# EAGLE schematic 1090-2 (EAGLE 6.0)
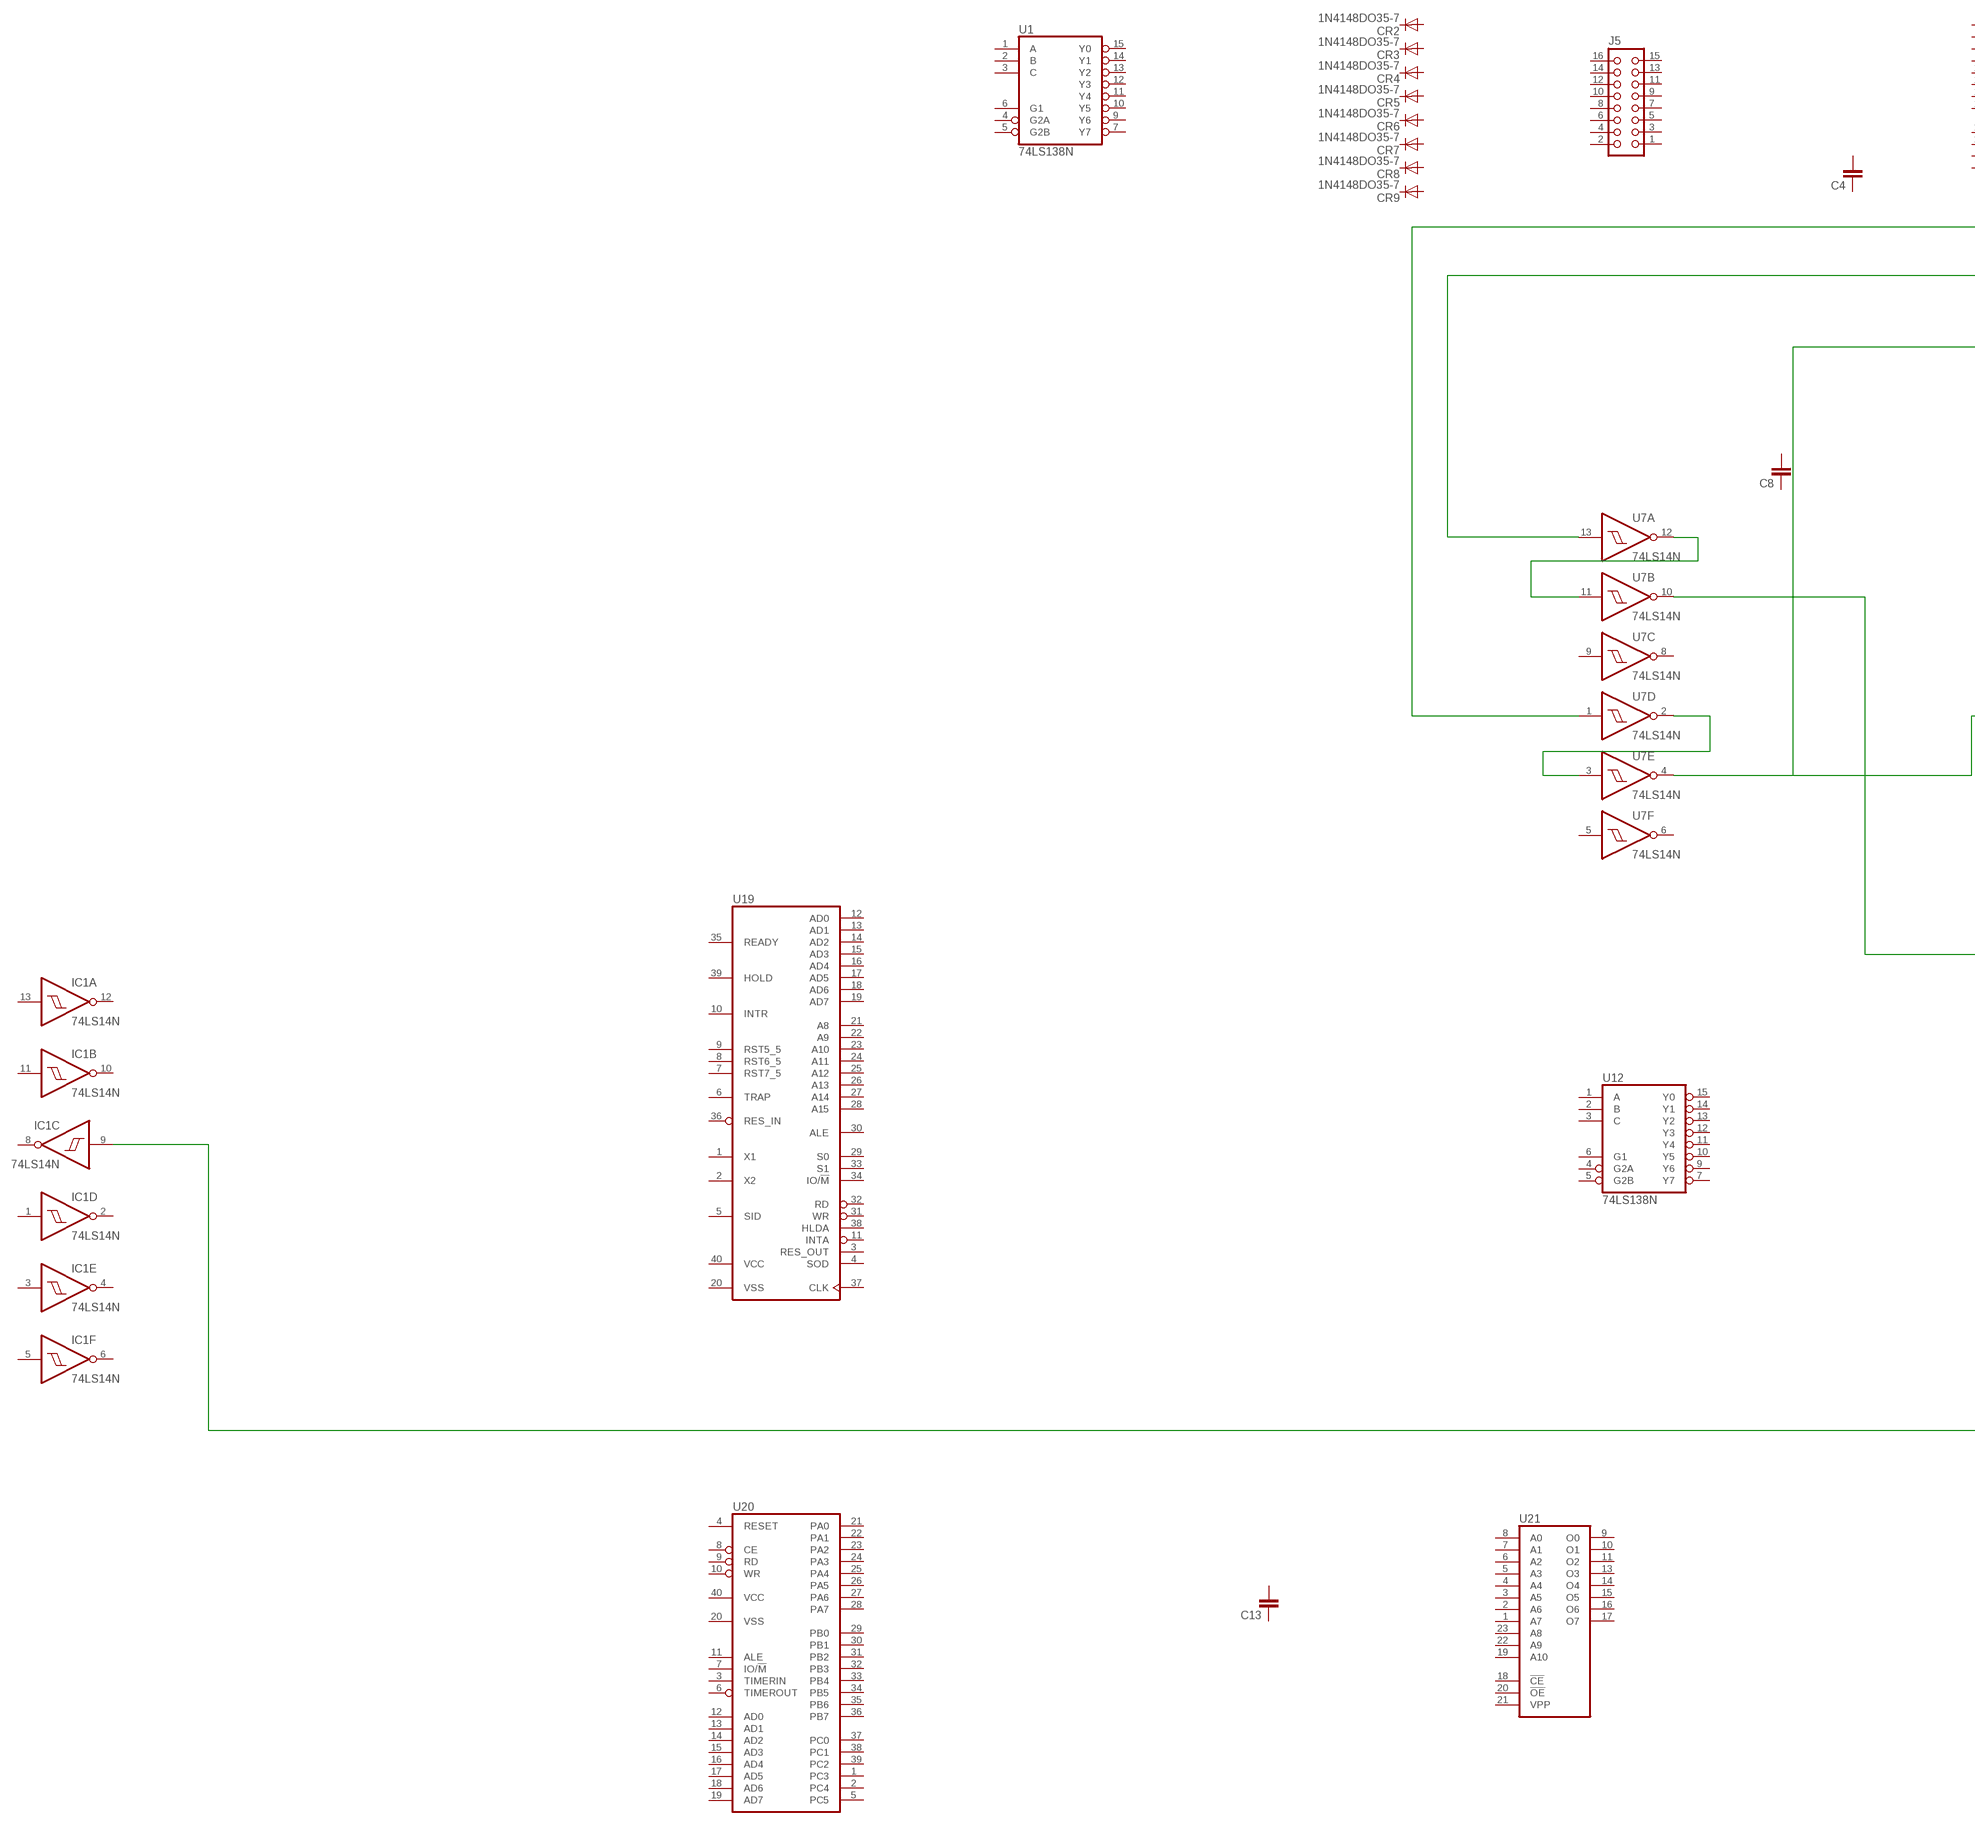
[diagram p0: schematic, sheet 1, part 1 of 3]
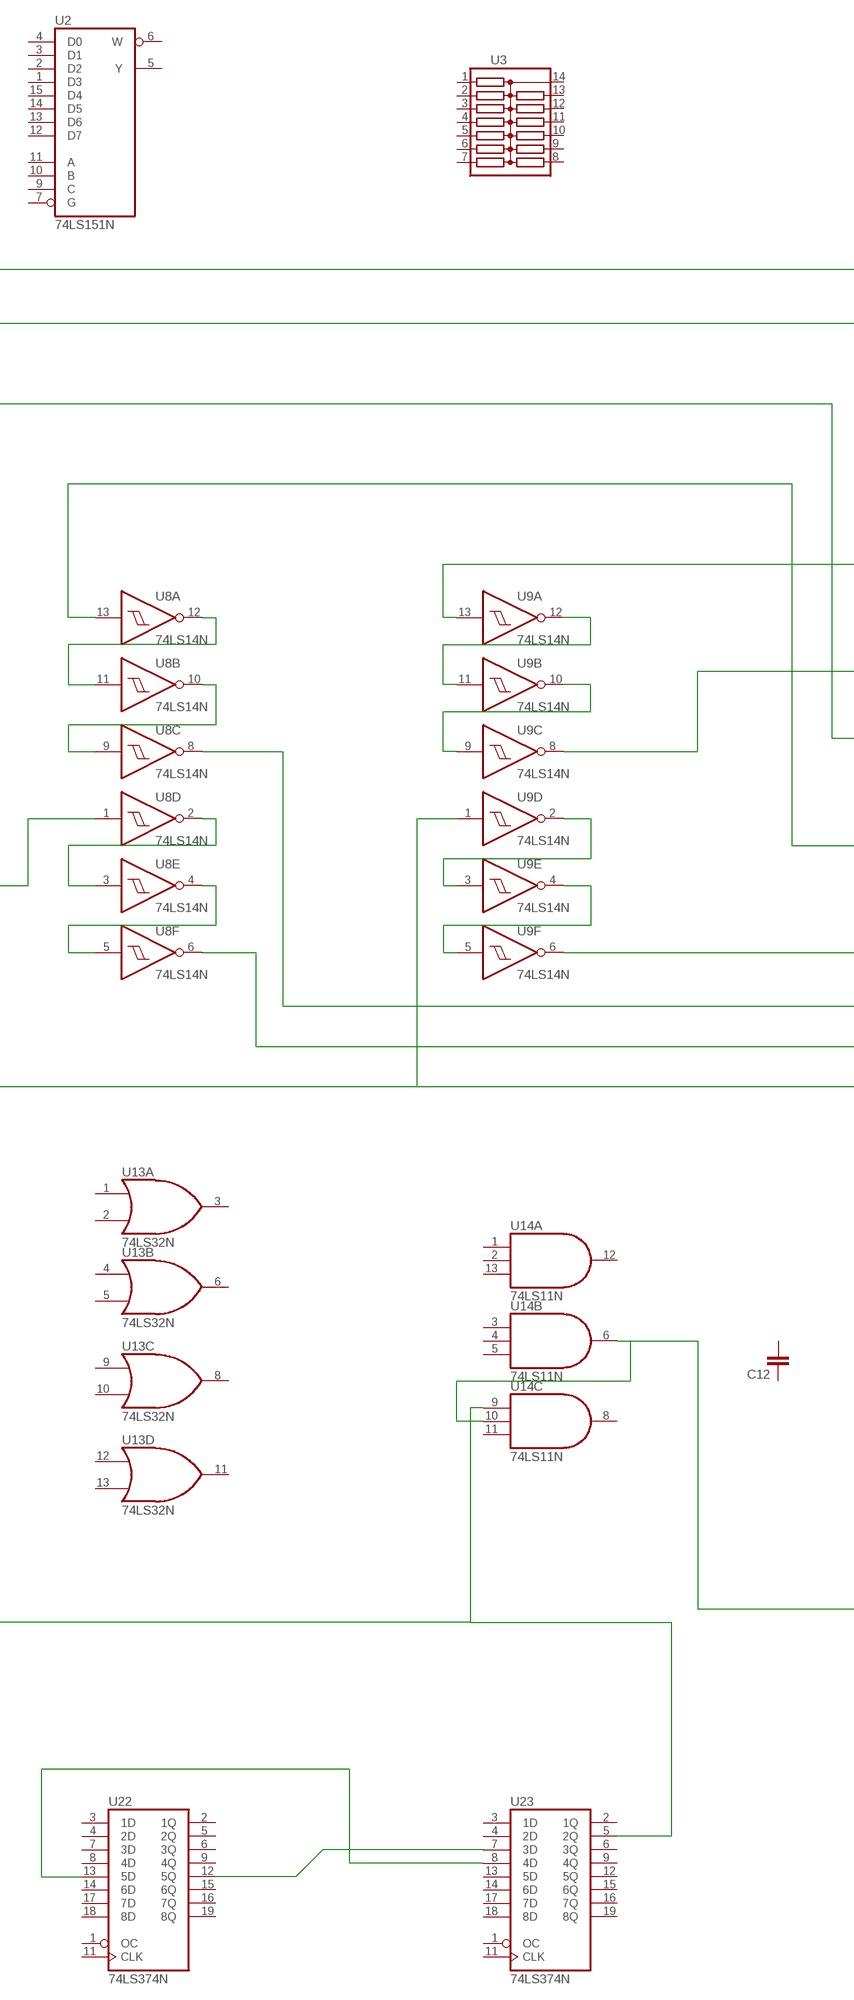
[diagram p1: schematic, sheet 1, part 2 of 3]
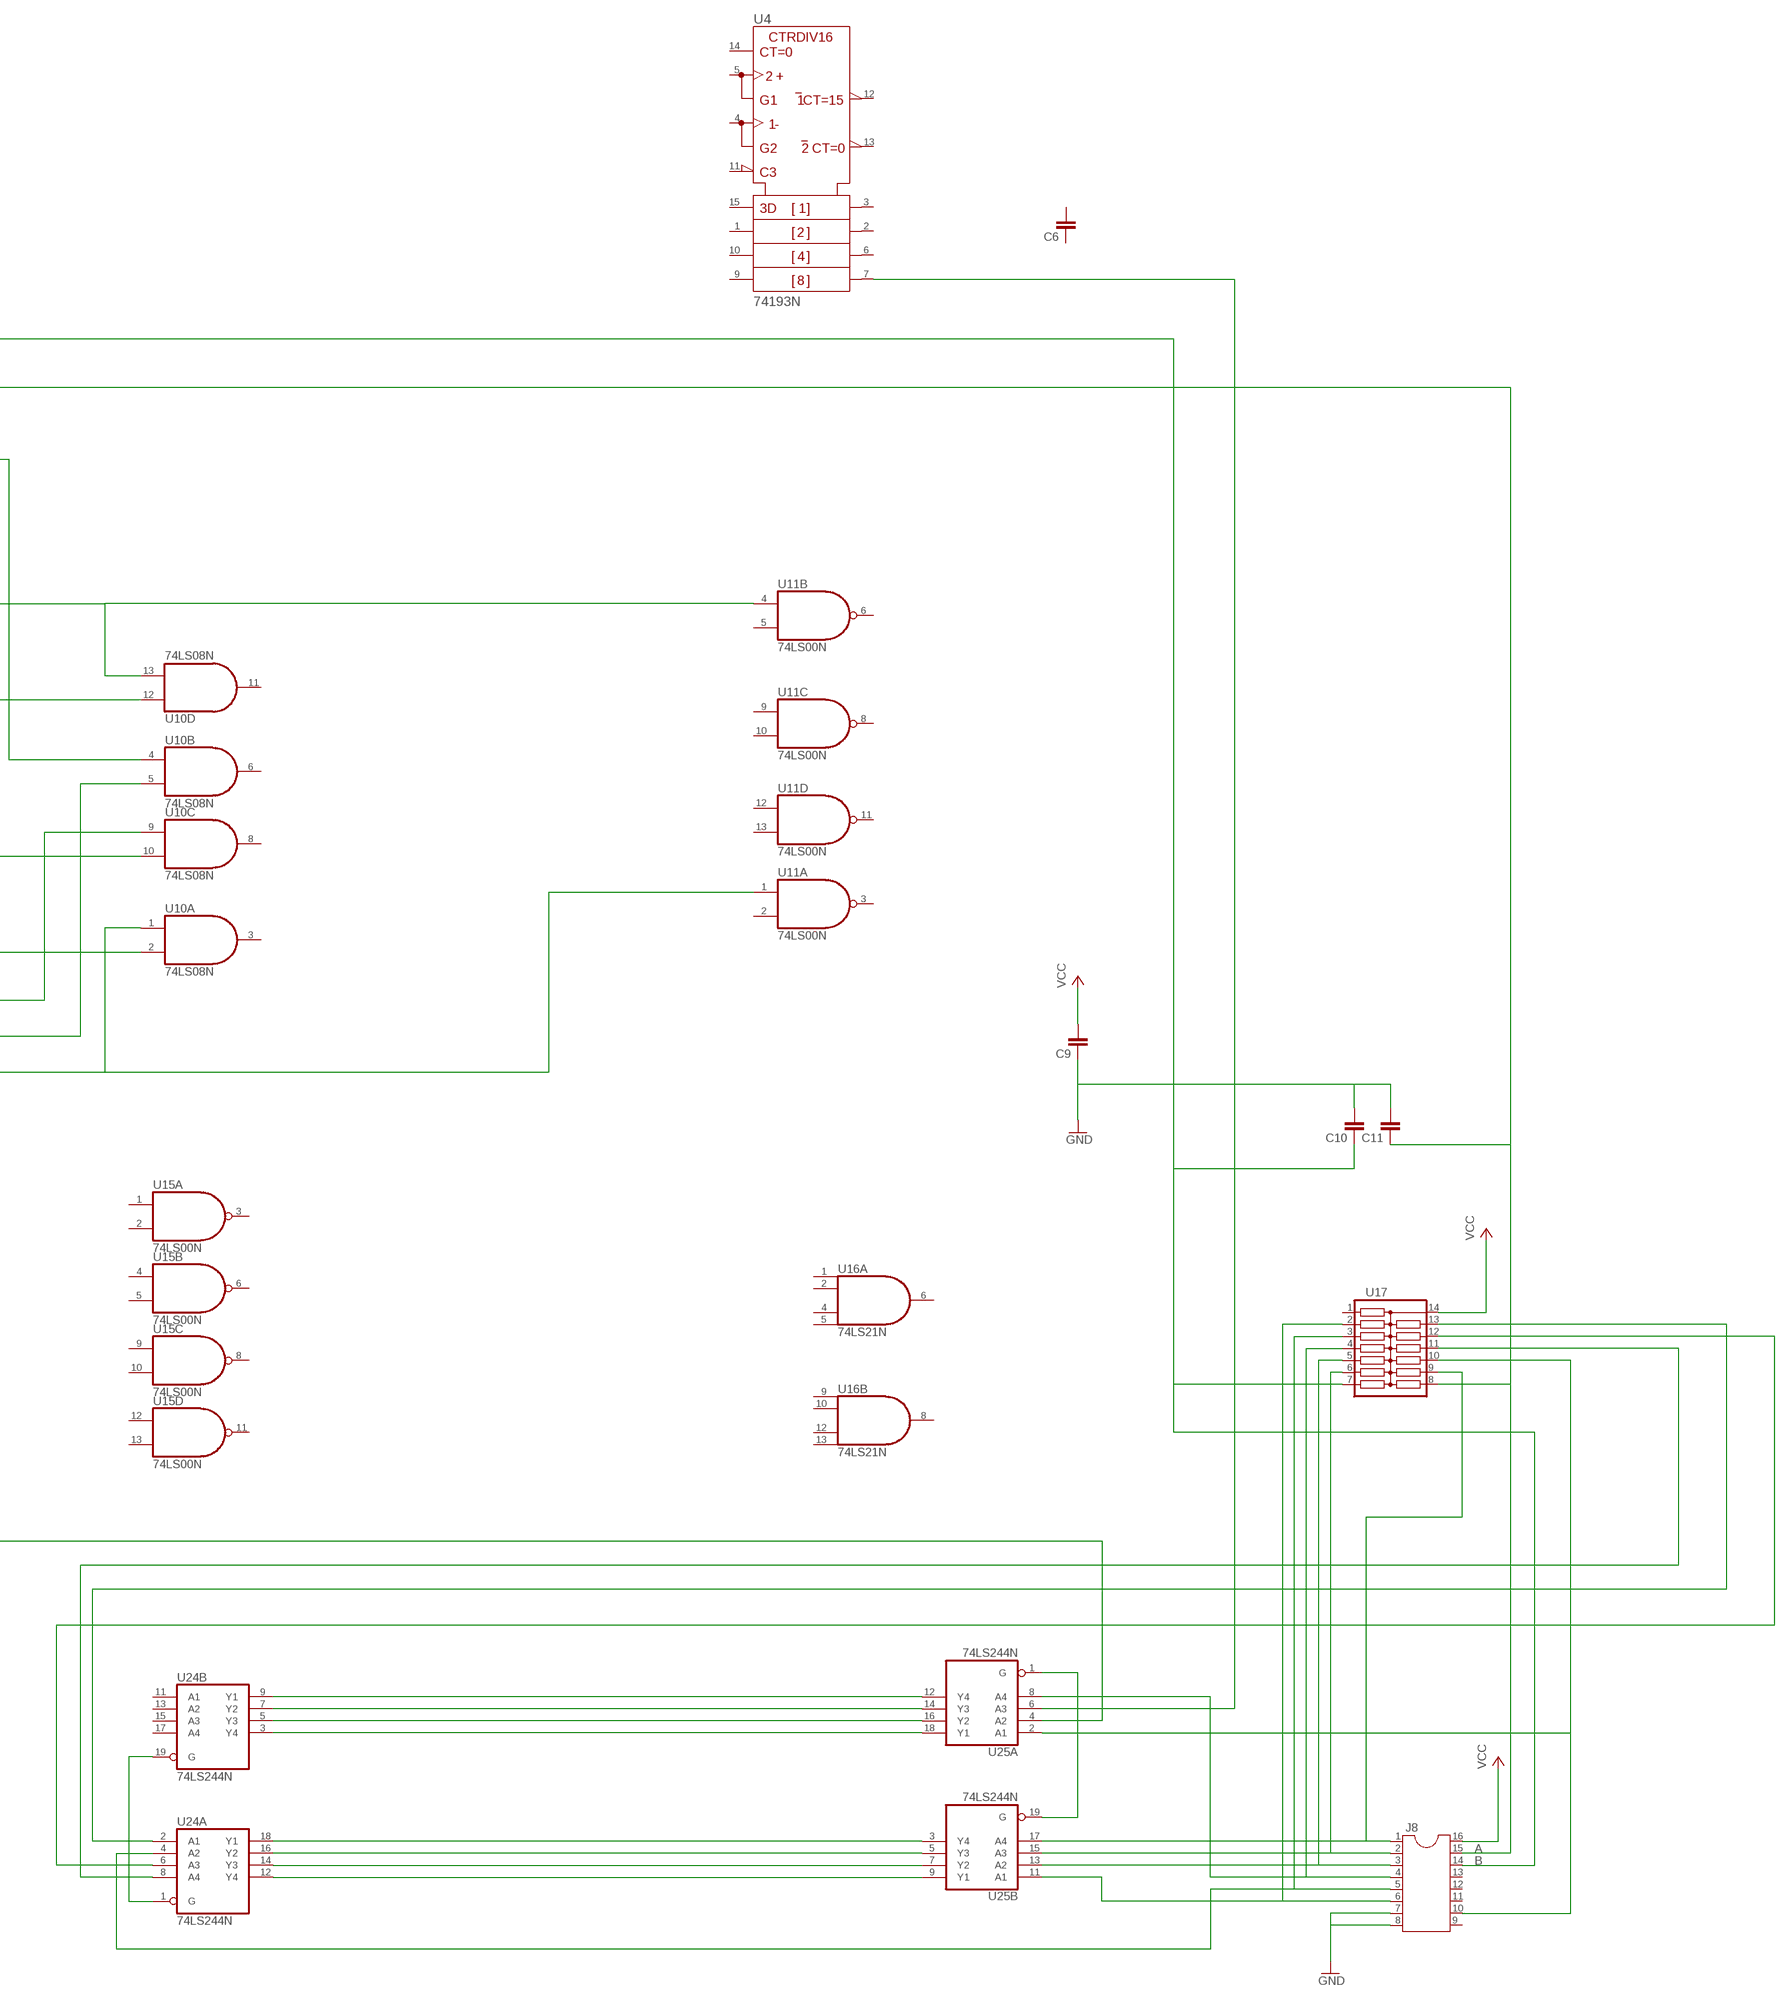
[diagram p2: schematic, sheet 1, part 3 of 3]

## Parts
C4  C7.5/3  [C7.5B3]
C6  C7.5/3  [C7.5B3]
C8  C7.5/3  [C7.5B3]
C9  C7.5/3  [C7.5B3]
C10  C7.5/3  [C7.5B3]
C11  C7.5/3  [C7.5B3]
C12  C7.5/3  [C7.5B3]
C13  C7.5/3  [C7.5B3]
CR2  1N4148DO35-7  [DO35-7]
CR3  1N4148DO35-7  [DO35-7]
CR4  1N4148DO35-7  [DO35-7]
CR5  1N4148DO35-7  [DO35-7]
CR6  1N4148DO35-7  [DO35-7]
CR7  1N4148DO35-7  [DO35-7]
CR8  1N4148DO35-7  [DO35-7]
CR9  1N4148DO35-7  [DO35-7]
IC1  74LS14N  [DIL14]
J5  CON16L  [CON16L]
J8  DIL16S  [SOCKET-16]
U1  74LS138N  [DIL16]
U2  74LS151N  [DIL16]
U3  13R  [DIL14]
U4  74193N  [DIL16]
U7  74LS14N  [DIL14]
U8  74LS14N  [DIL14]
U9  74LS14N  [DIL14]
U10  74LS08N  [DIL14]
U11  74LS00N  [DIL14]
U12  74LS138N  [DIL16]
U13  74LS32N  [DIL14]
U14  74LS11N  [DIL14]
U15  74LS00N  [DIL14]
U16  74LS21N  [DIL14]
U17  13R  [DIL14]
U19  8085  [DIL40]
U20  8155  [DIL40]
U21  2716  [DIL24]
U22  74LS374N  [DIL20]
U23  74LS374N  [DIL20]
U24  74LS244N  [DIL20]
U25  74LS244N  [DIL20]

## Nets
A: C11.1 J8.15 U7.13(A:I) U17.8
B: C10.1 J8.14 U7.1(D:I) U17.7
GND: C9.1 C10.2 C11.2 J8.7 J8.8
N$1: J8.1 U17.9 U25.17(B:A4)
N$2: J8.2 U17.6 U25.15(B:A3)
N$3: J8.3 U17.5 U25.13(B:A2)
N$4: J8.6 U17.2 U25.11(B:A1)
N$5: U22.12(5Q) U23.7(3D)
N$6: U22.13(5D) U23.8(4D)
N$7: U24.18(A:Y1) U25.3(B:Y4)
N$8: U24.16(A:Y2) U25.5(B:Y3)
N$9: U24.14(A:Y3) U25.7(B:Y2)
N$10: U24.12(A:Y4) U25.9(B:Y1)
N$11: U25.1(A:G) U25.19(B:G)
N$12: U24.3(B:Y4) U25.18(A:Y1)
N$13: U24.5(B:Y3) U25.16(A:Y2)
N$14: U24.7(B:Y2) U25.14(A:Y3)
N$15: U24.9(B:Y1) U25.12(A:Y4)
N$16: U24.1(A:G) U24.19(B:G)
N$17: U14.6(B:O) U14.10(C:I1) U25.4(A:A2)
N$18: J8.4 U17.4 U25.8(A:A4)
N$19: IC1.9(C:I) U14.9(C:I0) U23.5(2Q)
N$20: U4.7(QD) U25.6(A:A3)
N$22: J8.5 U17.3 U24.4(A:A2)
N$23: J8.10 U17.10 U25.2(A:A1)
N$24: U17.13 U24.2(A:A1)
N$25: U7.2(D:O) U7.3(E:I)
N$26: U7.11(B:I) U7.12(A:O)
N$27: U7.4(E:O) U8.1(D:I) U10.4(B:I0)
N$28: U7.10(B:O) U9.1(D:I) U10.1(A:I0) U11.1(A:I0)
N$29: U9.2(D:O) U9.3(E:I)
N$30: U9.4(E:O) U9.5(F:I)
N$31: U9.9(C:I) U9.10(B:O)
N$32: U9.11(B:I) U9.12(A:O)
N$33: U9.6(F:O) U10.2(A:I1)
N$34: U9.8(C:O) U10.12(D:I0)
N$35: U9.13(A:I) U10.13(D:I1) U11.4(B:I0)
N$36: U17.12 U24.6(A:A3)
N$37: U8.2(D:O) U8.3(E:I)
N$38: U8.4(E:O) U8.5(F:I)
N$39: U8.11(B:I) U8.12(A:O)
N$40: U8.9(C:I) U8.10(B:O)
N$41: U8.13(A:I) U10.10(C:I1)
N$42: U8.8(C:O) U10.9(C:I0)
N$43: U8.6(F:O) U10.5(B:I1)
N$44: U17.11 U24.8(A:A4)
VCC: C9.2 J8.16 U17.14
Unconnected: C4.1 C4.2 C6.1 C6.2 C8.1 C8.2 C12.1 C12.2 C13.1 C13.2 CR2.A CR2.C CR3.A CR3.C CR4.A CR4.C CR5.A CR5.C CR6.A CR6.C CR7.A CR7.C CR8.A CR8.C CR9.A CR9.C IC1.1(D:I) IC1.2(D:O) IC1.3(E:I) IC1.4(E:O) IC1.5(F:I) IC1.6(F:O) IC1.8(C:O) IC1.10(B:O) IC1.11(B:I) IC1.12(A:O) IC1.13(A:I) J5.1 J5.2 J5.3 J5.4 J5.5 J5.6 J5.7 J5.8 J5.9 J5.10 J5.11 J5.12 J5.13 J5.14 J5.15 J5.16 J8.9 J8.11 J8.12 J8.13 U1.1(A) U1.2(B) U1.3(C) U1.4(G2A) U1.5(G2B) U1.6(G1) U1.7(Y7) U1.9(Y6) U1.10(Y5) U1.11(Y4) U1.12(Y3) U1.13(Y2) U1.14(Y1) U1.15(Y0) U2.1(D3) U2.2(D2) U2.3(D1) U2.4(D0) U2.5(Y) U2.6(W) U2.7(G) U2.9(C) U2.10(B) U2.11(A) U2.12(D7) U2.13(D6) U2.14(D5) U2.15(D4) U3.1 U3.2 U3.3 U3.4 U3.5 U3.6 U3.7 U3.8 U3.9 U3.10 U3.11 U3.12 U3.13 U3.14 U4.1(B) U4.2(QB) U4.3(QA) U4.4(DOWN) U4.5(UP) U4.6(QC) U4.9(D) U4.10(C) U4.11(!LOAD) U4.12(!CO) U4.13(!BO) U4.14(CLR) U4.15(A) U7.5(F:I) U7.6(F:O) U7.8(C:O) U7.9(C:I) U10.3(A:O) U10.6(B:O) U10.8(C:O) U10.11(D:O) U11.2(A:I1) U11.3(A:O) U11.5(B:I1) U11.6(B:O) U11.8(C:O) U11.9(C:I0) U11.10(C:I1) U11.11(D:O) U11.12(D:I0) U11.13(D:I1) U12.1(A) U12.2(B) U12.3(C) U12.4(G2A) U12.5(G2B) U12.6(G1) U12.7(Y7) U12.9(Y6) U12.10(Y5) U12.11(Y4) U12.12(Y3) U12.13(Y2) U12.14(Y1) U12.15(Y0) U13.1(A:I0) U13.2(A:I1) U13.3(A:O) U13.4(B:I0) U13.5(B:I1) U13.6(B:O) U13.8(C:O) U13.9(C:I0) U13.10(C:I1) U13.11(D:O) U13.12(D:I0) U13.13(D:I1) U14.1(A:I0) U14.2(A:I1) U14.3(B:I0) U14.4(B:I1) U14.5(B:I2) U14.8(C:O) U14.11(C:I2) U14.12(A:O) U14.13(A:I2) U15.1(A:I0) U15.2(A:I1) U15.3(A:O) U15.4(B:I0) U15.5(B:I1) U15.6(B:O) U15.8(C:O) U15.9(C:I0) U15.10(C:I1) U15.11(D:O) U15.12(D:I0) U15.13(D:I1) U16.1(A:I0) U16.2(A:I1) U16.4(A:I2) U16.5(A:I3) U16.6(A:O) U16.8(B:O) U16.9(B:I0) U16.10(B:I1) U16.12(B:I2) U16.13(B:I3) U17.1 U19.1(X1) U19.2(X2) U19.3(RES_OUT) U19.4(SOD) U19.5(SID) U19.6(TRAP) U19.7(RST7_5) U19.8(RST6_5) U19.9(RST5_5) U19.10(INTR) U19.11(INTA) U19.12(AD0) U19.13(AD1) U19.14(AD2) U19.15(AD3) U19.16(AD4) U19.17(AD5) U19.18(AD6) U19.19(AD7) U19.21(A8) U19.22(A9) U19.23(A10) U19.24(A11) U19.25(A12) U19.26(A13) U19.27(A14) U19.28(A15) U19.29(S0) U19.30(ALE) U19.31(WR) U19.32(RD) U19.33(S1) U19.34(IO/!M) U19.35(READY) U19.36(RES_IN) U19.37(CLK) U19.38(HLDA) U19.39(HOLD) U20.1(PC3) U20.2(PC4) U20.3(TIMERIN) U20.4(RESET) U20.5(PC5) U20.6(TIMEROUT) U20.7(IO/!M) U20.8(CE) U20.9(RD) U20.10(WR) U20.11(ALE) U20.12(AD0) U20.13(AD1) U20.14(AD2) U20.15(AD3) U20.16(AD4) U20.17(AD5) U20.18(AD6) U20.19(AD7) U20.21(PA0) U20.22(PA1) U20.23(PA2) U20.24(PA3) U20.25(PA4) U20.26(PA5) U20.27(PA6) U20.28(PA7) U20.29(PB0) U20.30(PB1) U20.31(PB2) U20.32(PB3) U20.33(PB4) U20.34(PB5) U20.35(PB6) U20.36(PB7) U20.37(PC0) U20.38(PC1) U20.39(PC2) U21.1(A7) U21.2(A6) U21.3(A5) U21.4(A4) U21.5(A3) U21.6(A2) U21.7(A1) U21.8(A0) U21.9(O0) U21.10(O1) U21.11(O2) U21.13(O3) U21.14(O4) U21.15(O5) U21.16(O6) U21.17(O7) U21.18(!CE) U21.19(A10) U21.20(!OE) U21.21(VPP) U21.22(A9) U21.23(A8) U22.1(OC) U22.2(1Q) U22.3(1D) U22.4(2D) U22.5(2Q) U22.6(3Q) U22.7(3D) U22.8(4D) U22.9(4Q) U22.11(CLK) U22.14(6D) U22.15(6Q) U22.16(7Q) U22.17(7D) U22.18(8D) U22.19(8Q) U23.1(OC) U23.2(1Q) U23.3(1D) U23.4(2D) U23.6(3Q) U23.9(4Q) U23.11(CLK) U23.12(5Q) U23.13(5D) U23.14(6D) U23.15(6Q) U23.16(7Q) U23.17(7D) U23.18(8D) U23.19(8Q) U24.11(B:A1) U24.13(B:A2) U24.15(B:A3) U24.17(B:A4)

## Power pins joined to a net without a drawn wire
+UB: U4.16(+UB)
-UB: U4.8(-UB)
GND: IC1.7(P:GND) U1.8(GND) U2.8(GND) U7.7(P:GND) U8.7(P:GND) U9.7(P:GND) U10.7(P:GND) U11.7(P:GND) U12.8(GND) U13.7(P:GND) U14.7(P:GND) U15.7(P:GND) U16.7(P:GND) U21.12(GND) U22.10(GND) U23.10(GND) U24.10(P:GND) U25.10(P:GND)
VCC: IC1.14(P:VCC) U1.16(VCC) U2.16(VCC) U7.14(P:VCC) U8.14(P:VCC) U9.14(P:VCC) U10.14(P:VCC) U11.14(P:VCC) U12.16(VCC) U13.14(P:VCC) U14.14(P:VCC) U15.14(P:VCC) U16.14(P:VCC) U19.40(VCC) U20.40(VCC) U21.24(VCC) U22.20(VCC) U23.20(VCC) U24.20(P:VCC) U25.20(P:VCC)
VSS: U19.20(VSS) U20.20(VSS)

## Library data of the parts
C4 C6 C8-C13 = capacitor-wima:C: CAPACITOR naming: grid - package width
CR2-CR9 = diode:1N4148: DIODE high speed (Philips)
IC1 U7-U9 = 74xx-us:74*14: Hex schmitt trigger INVERTER
J5 = con-harting:CON16L: CONNECTOR; OC_FARNELL: unknown; OC_NEWARK: unknown
J8 = ic-package:DIL16: Dual In Line / Socket
U1 U12 = 74xx-us:74*138: 3-line to 8-line DECODER/DEMULTIPLEXER
U2 = 74xx-us:74*151: Data SELECTOR/MULTIPLEXER
U3 U17 = resistor-dil:13R: DIL RESISTOR; OC_FARNELL: unknown; OC_NEWARK: unknown
U4 = 74ttl-din:74*193: Synchronus 4-bit up down COUNTER
U10 = 74xx-us:74*08: Quad 2-input AND gate
U11 U15 = 74xx-us:74*00: Quad 2-input NAND gate
U13 = 74xx-us:74*32: Quad 2-input OR gate
U14 = 74xx-us:74*11: Triple 3-input AND gate
U16 = 74xx-us:74*21: Dual 4-input AND gate
U19 = micro-intel:8085: MICROCOMPUTER/PERIPHERAL DEVICE; OC_FARNELL: unknown; OC_NEWARK: unknown
U20 = micro-intel:8155: MICROCOMPUTER/PERIPHERAL DEVICE; OC_FARNELL: unknown; OC_NEWARK: unknown
U21 = memory:2716: MEMORY
U22 U23 = 74xx-us:74*374: Octal D type transparent LATCH, edge triggered
U24 U25 = 74xx-us:74*244: Octal BUFFER and LINE DRIVER, 3-state